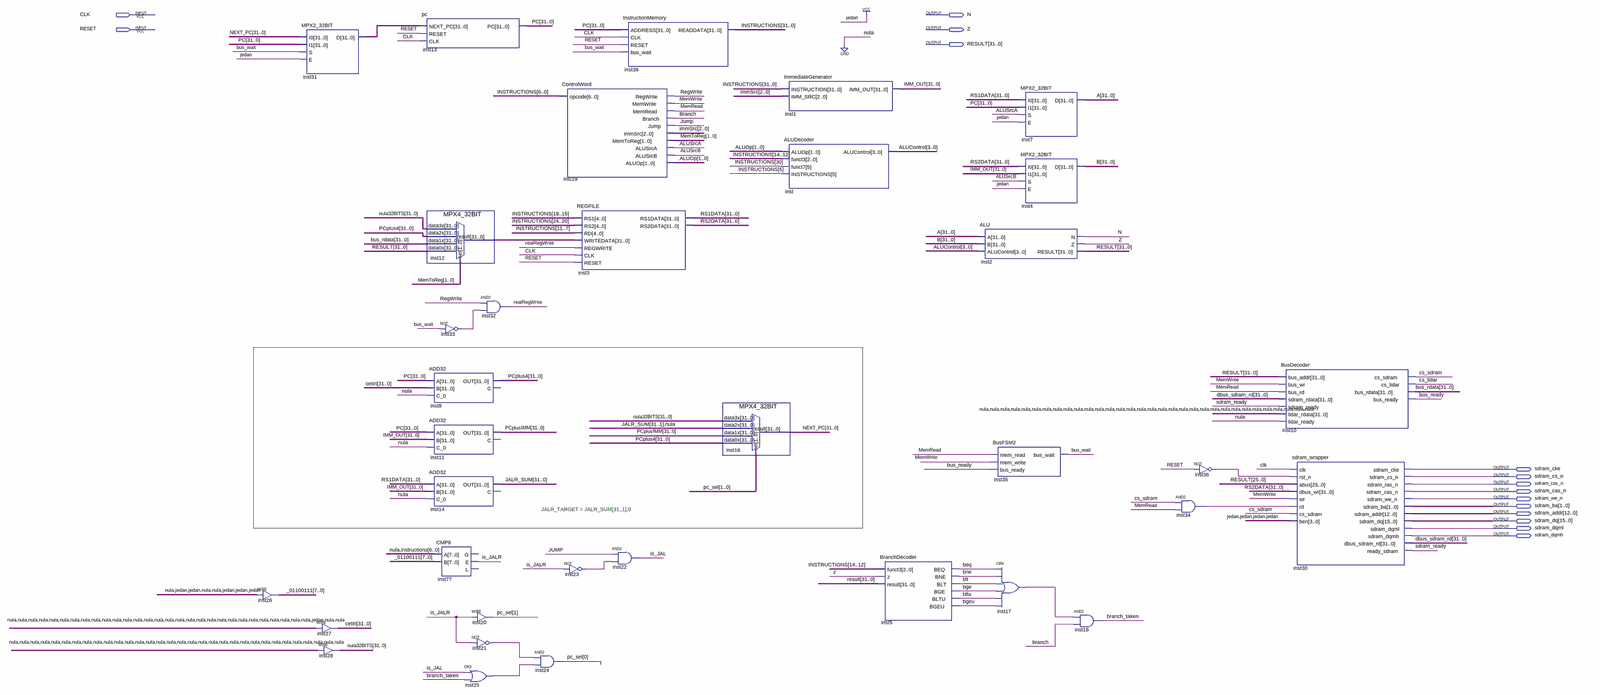
[diagram p0: schematic sheet, whole]
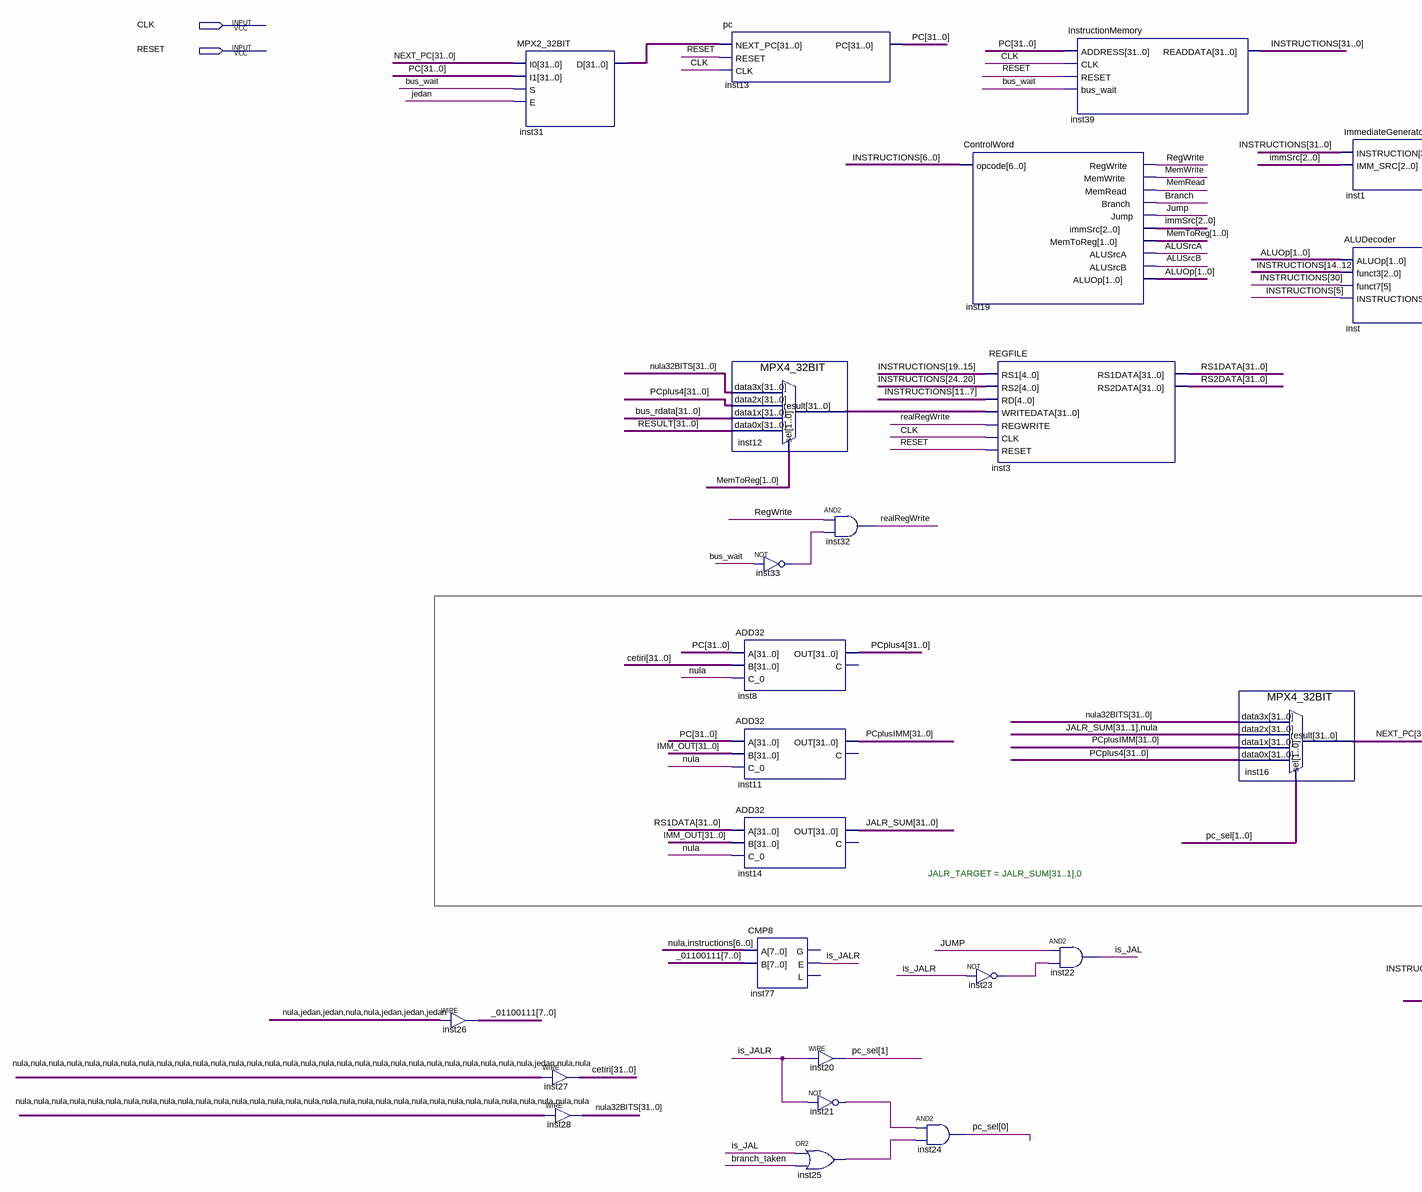
[diagram p1: schematic sheet, left part]
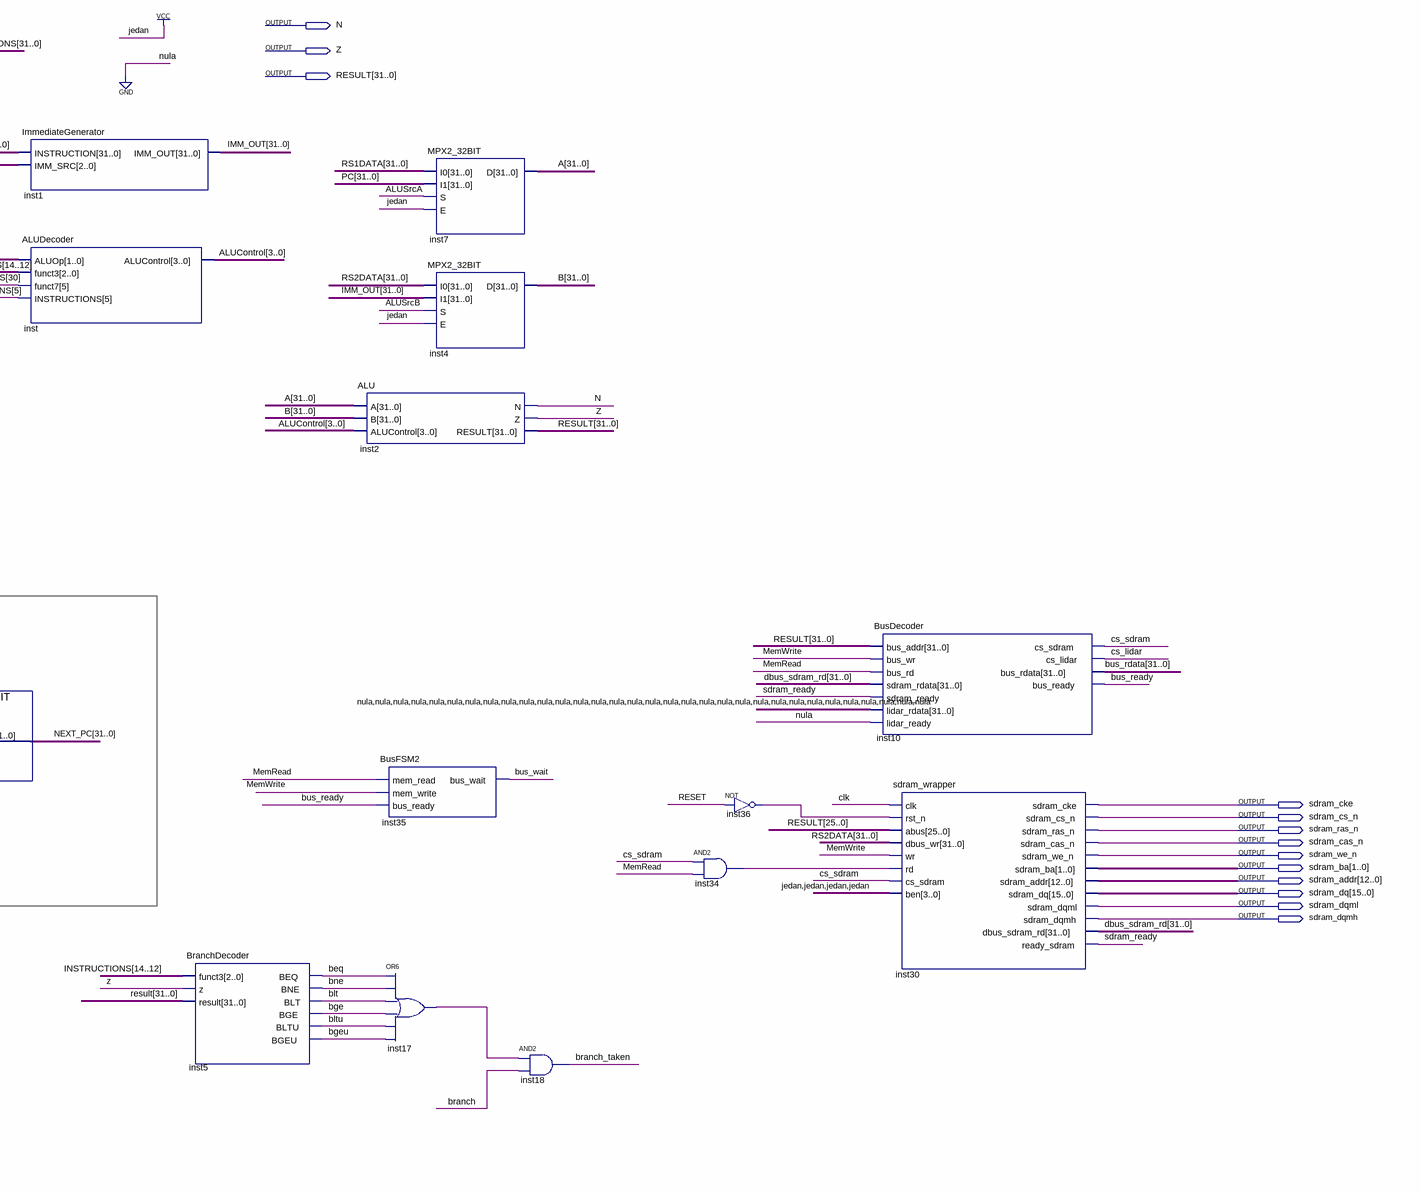
[diagram p2: schematic sheet, right part]
// Quartus schematic riscv32i_2.bdf as structural Verilog: 35 symbols, 15 pins
module riscv32i_2 (
  input  CLK,
  input  RESET,
  output N,
  output Z,
  output [31:0] RESULT,
  output sdram_cke,
  output sdram_cs_n,
  output sdram_ras_n,
  output sdram_cas_n,
  output sdram_we_n,
  output [1:0] sdram_ba,
  output [12:0] sdram_addr,
  output [15:0] sdram_dq,
  output sdram_dqml,
  output sdram_dqmh
);

  wire ALUSrcA, ALUSrcB, beq, bge, bgeu, blt, bltu, bne, Branch, branch_taken, bus_ready, bus_wait, cs_lidar,
       cs_sdram, inst17_out, inst21_out, inst23_out, inst25_out, inst33_out, inst34_out, inst36_out, is_JAL,
       is_JALR, Jump, MemRead, MemWrite, realRegWrite, RegWrite, sdram_ready;
  wire [1:0] ALUOp, MemToReg, pc_sel;
  wire [2:0] immSrc;
  wire [3:0] ALUControl;
  wire [7:0] _01100111;
  wire [31:0] A, B, bus_rdata, cetiri, dbus_sdram_rd, IMM_OUT, inst12_result, inst31_d, INSTRUCTIONS,
       JALR_SUM, NEXT_PC, nula32BITS, PC, PCplus4, PCplusIMM, RS1DATA, RS2DATA;

  assign _01100111 = 8'b01100111;  // WIRE inst26
  MPX2_32BIT inst31 (.I0(NEXT_PC), .I1(PC), .S(bus_wait), .E(1'b1), .D(inst31_d));
  assign cetiri = 32'b00000000000000000000000000000100;  // WIRE inst27
  assign nula32BITS = {32{1'b0}};  // WIRE inst28
  pc inst13 (.NEXT_PC(inst31_d), .RESET(RESET), .CLK(CLK), .PC(PC));
  MPX4_32BIT inst12 (
    .data3x(nula32BITS), .data2x(PCplus4), .data1x(bus_rdata), .data0x(RESULT), .sel(MemToReg),
    .result(inst12_result));
  ADD32 inst8 (.A(PC), .B(cetiri), .C_0(1'b0), .OUT(PCplus4));  // open: C
  ADD32 inst11 (.A(PC), .B(IMM_OUT), .C_0(1'b0), .OUT(PCplusIMM));  // open: C
  ADD32 inst14 (.A(RS1DATA), .B(IMM_OUT), .C_0(1'b0), .OUT(JALR_SUM));  // open: C
  CMP8 inst77 (.A({1'b0, INSTRUCTIONS[6:0]}), .B(_01100111), .E(is_JALR));  // open: G, L
  not inst33 (inst33_out, bus_wait);
  or inst25 (inst25_out, is_JAL, branch_taken);
  and inst32 (realRegWrite, RegWrite, inst33_out);
  assign pc_sel[1] = is_JALR;  // WIRE inst20
  not inst21 (inst21_out, is_JALR);
  and inst24 (pc_sel[0], inst21_out, inst25_out);
  ControlWord inst19 (
    .opcode(INSTRUCTIONS[6:0]), .RegWrite(RegWrite), .MemWrite(MemWrite), .MemRead(MemRead), .Branch(Branch),
    .Jump(Jump), .immSrc(immSrc), .MemToReg(MemToReg), .ALUSrcA(ALUSrcA), .ALUSrcB(ALUSrcB), .ALUOp(ALUOp));
  REGFILE inst3 (
    .RS1(INSTRUCTIONS[19:15]), .RS2(INSTRUCTIONS[24:20]), .RD(INSTRUCTIONS[11:7]), .WRITEDATA(inst12_result),
    .REGWRITE(realRegWrite), .CLK(CLK), .RESET(RESET), .RS1DATA(RS1DATA), .RS2DATA(RS2DATA));
  not inst23 (inst23_out, is_JALR);
  and inst22 (is_JAL, Jump, inst23_out);
  InstructionMemory inst39 (.ADDRESS(PC), .CLK(CLK), .RESET(RESET), .bus_wait(bus_wait), .READDATA(INSTRUCTIONS));
  MPX4_32BIT inst16 (
    .data3x(nula32BITS), .data2x({JALR_SUM[31:1], 1'b0}), .data1x(PCplusIMM), .data0x(PCplus4), .sel(pc_sel),
    .result(NEXT_PC));
  ImmediateGenerator inst1 (.INSTRUCTION(INSTRUCTIONS), .IMM_SRC(immSrc), .IMM_OUT(IMM_OUT));
  ALUDecoder inst (
    .ALUOp(ALUOp), .funct3(INSTRUCTIONS[14:12]), .funct7(INSTRUCTIONS[30]), .INSTRUCTIONS(INSTRUCTIONS[5]),
    .ALUControl(ALUControl));
  BranchDecoder inst5 (
    .funct3(INSTRUCTIONS[14:12]), .z(Z), .result(RESULT), .BEQ(beq), .BNE(bne), .BLT(blt), .BGE(bge),
    .BLTU(bltu), .BGEU(bgeu));
  ALU inst2 (.A(A), .B(B), .ALUControl(ALUControl), .N(N), .Z(Z), .RESULT(RESULT));
  BusFSM2 inst35 (.mem_read(MemRead), .mem_write(MemWrite), .bus_ready(bus_ready), .bus_wait(bus_wait));
  or inst17 (inst17_out, beq, bne, blt, bge, bltu, bgeu);
  MPX2_32BIT inst7 (.I0(RS1DATA), .I1(PC), .S(ALUSrcA), .E(1'b1), .D(A));
  MPX2_32BIT inst4 (.I0(RS2DATA), .I1(IMM_OUT), .S(ALUSrcB), .E(1'b1), .D(B));
  and inst18 (branch_taken, inst17_out, Branch);
  not inst36 (inst36_out, RESET);
  and inst34 (inst34_out, cs_sdram, MemRead);
  BusDecoder inst10 (
    .bus_addr(RESULT), .bus_wr(MemWrite), .bus_rd(MemRead), .sdram_rdata(dbus_sdram_rd),
    .sdram_ready(sdram_ready), .lidar_rdata({32{1'b0}}), .lidar_ready(1'b0), .cs_sdram(cs_sdram),
    .cs_lidar(cs_lidar), .bus_rdata(bus_rdata), .bus_ready(bus_ready));
  sdram_wrapper inst30 (
    .clk(CLK), .rst_n(inst36_out), .abus(RESULT[25:0]), .dbus_wr(RS2DATA), .wr(MemWrite), .rd(inst34_out),
    .cs_sdram(cs_sdram), .ben(4'b1111), .sdram_cke(sdram_cke), .sdram_cs_n(sdram_cs_n),
    .sdram_ras_n(sdram_ras_n), .sdram_cas_n(sdram_cas_n), .sdram_we_n(sdram_we_n), .sdram_ba(sdram_ba),
    .sdram_addr(sdram_addr), .sdram_dqml(sdram_dqml), .sdram_dqmh(sdram_dqmh), .dbus_sdram_rd(dbus_sdram_rd),
    .ready_sdram(sdram_ready), .sdram_dq(sdram_dq));

  // Notes on the sheet:
  //   JALR_TARGET = JALR_SUM[31..1],0
endmodule
